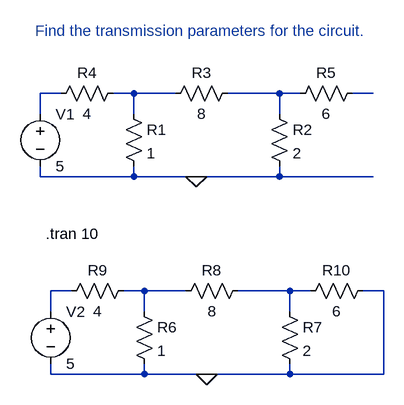
[diagram p0: schematic Lab7_ques3.asc]
Lab7_ques3.asc, the LTspice schematic file:
Version 4
SHEET 1 880 680
WIRE 64 160 32 160
WIRE 176 160 144 160
WIRE 240 160 176 160
WIRE 400 160 320 160
WIRE 432 160 400 160
WIRE 544 160 512 160
WIRE 32 192 32 160
WIRE 176 192 176 160
WIRE 400 192 400 160
WIRE 32 288 32 272
WIRE 176 288 176 272
WIRE 176 288 32 288
WIRE 272 288 176 288
WIRE 400 288 400 272
WIRE 400 288 272 288
WIRE 544 288 400 288
WIRE 80 464 48 464
WIRE 192 464 160 464
WIRE 256 464 192 464
WIRE 416 464 336 464
WIRE 448 464 416 464
WIRE 560 464 528 464
WIRE 48 496 48 464
WIRE 192 496 192 464
WIRE 416 496 416 464
WIRE 48 592 48 576
WIRE 192 592 192 576
WIRE 192 592 48 592
WIRE 288 592 192 592
WIRE 416 592 416 576
WIRE 416 592 288 592
WIRE 560 592 560 464
WIRE 560 592 416 592
FLAG 272 288 0
FLAG 288 592 0
SYMBOL Voltage 32 176 R0
SYMATTR InstName V1
SYMATTR Value 5
SYMBOL Res 160 176 R0
SYMATTR InstName R1
SYMATTR Value 1
SYMBOL Res 384 176 R0
SYMATTR InstName R2
SYMATTR Value 2
SYMBOL Res 336 144 R90
WINDOW 0 0 56 VBottom 2
WINDOW 3 32 56 VTop 2
SYMATTR InstName R3
SYMATTR Value 8
SYMBOL Res 160 144 R90
WINDOW 0 0 56 VBottom 2
WINDOW 3 32 56 VTop 2
SYMATTR InstName R4
SYMATTR Value 4
SYMBOL Res 528 144 R90
WINDOW 0 0 56 VBottom 2
WINDOW 3 32 56 VTop 2
SYMATTR InstName R5
SYMATTR Value 6
SYMBOL Res 176 480 R0
SYMATTR InstName R6
SYMATTR Value 1
SYMBOL Res 400 480 R0
SYMATTR InstName R7
SYMATTR Value 2
SYMBOL Res 352 448 R90
WINDOW 0 0 56 VBottom 2
WINDOW 3 32 56 VTop 2
SYMATTR InstName R8
SYMATTR Value 8
SYMBOL Res 176 448 R90
WINDOW 0 0 56 VBottom 2
WINDOW 3 32 56 VTop 2
SYMATTR InstName R9
SYMATTR Value 4
SYMBOL Res 544 448 R90
WINDOW 0 0 56 VBottom 2
WINDOW 3 32 56 VTop 2
SYMATTR InstName R10
SYMATTR Value 6
SYMBOL Voltage 48 480 R0
SYMATTR InstName V2
SYMATTR Value 5
TEXT 40 376 Left 2 !.tran 10
TEXT 24 64 Left 2 ;Find the transmission parameters for the circuit.

The netlist it stands for:
* Lab7_ques3.asc
V1 N001 0 5
R1 N002 0 1
R2 N003 0 2
R3 N003 N002 8
R4 N002 N001 4
R5 N004 N003 6
R6 N006 0 1
R7 N007 0 2
R8 N007 N006 8
R9 N006 N005 4
R10 0 N007 6
V2 N005 0 5
.tran 10
* Find the transmission parameters for the circuit.
.backanno
.end